# EasyEDA Pro project PCB.eprj

# Schematic Schematic1
Create Date: 2023-09-20; Page Name: P1; Project Name: 89C52RC灯板; Schematic Name: Schematic1; Update Date: 2023-09-20; Company: 嘉立创EDA; Page Size: A4; Version: V1.0
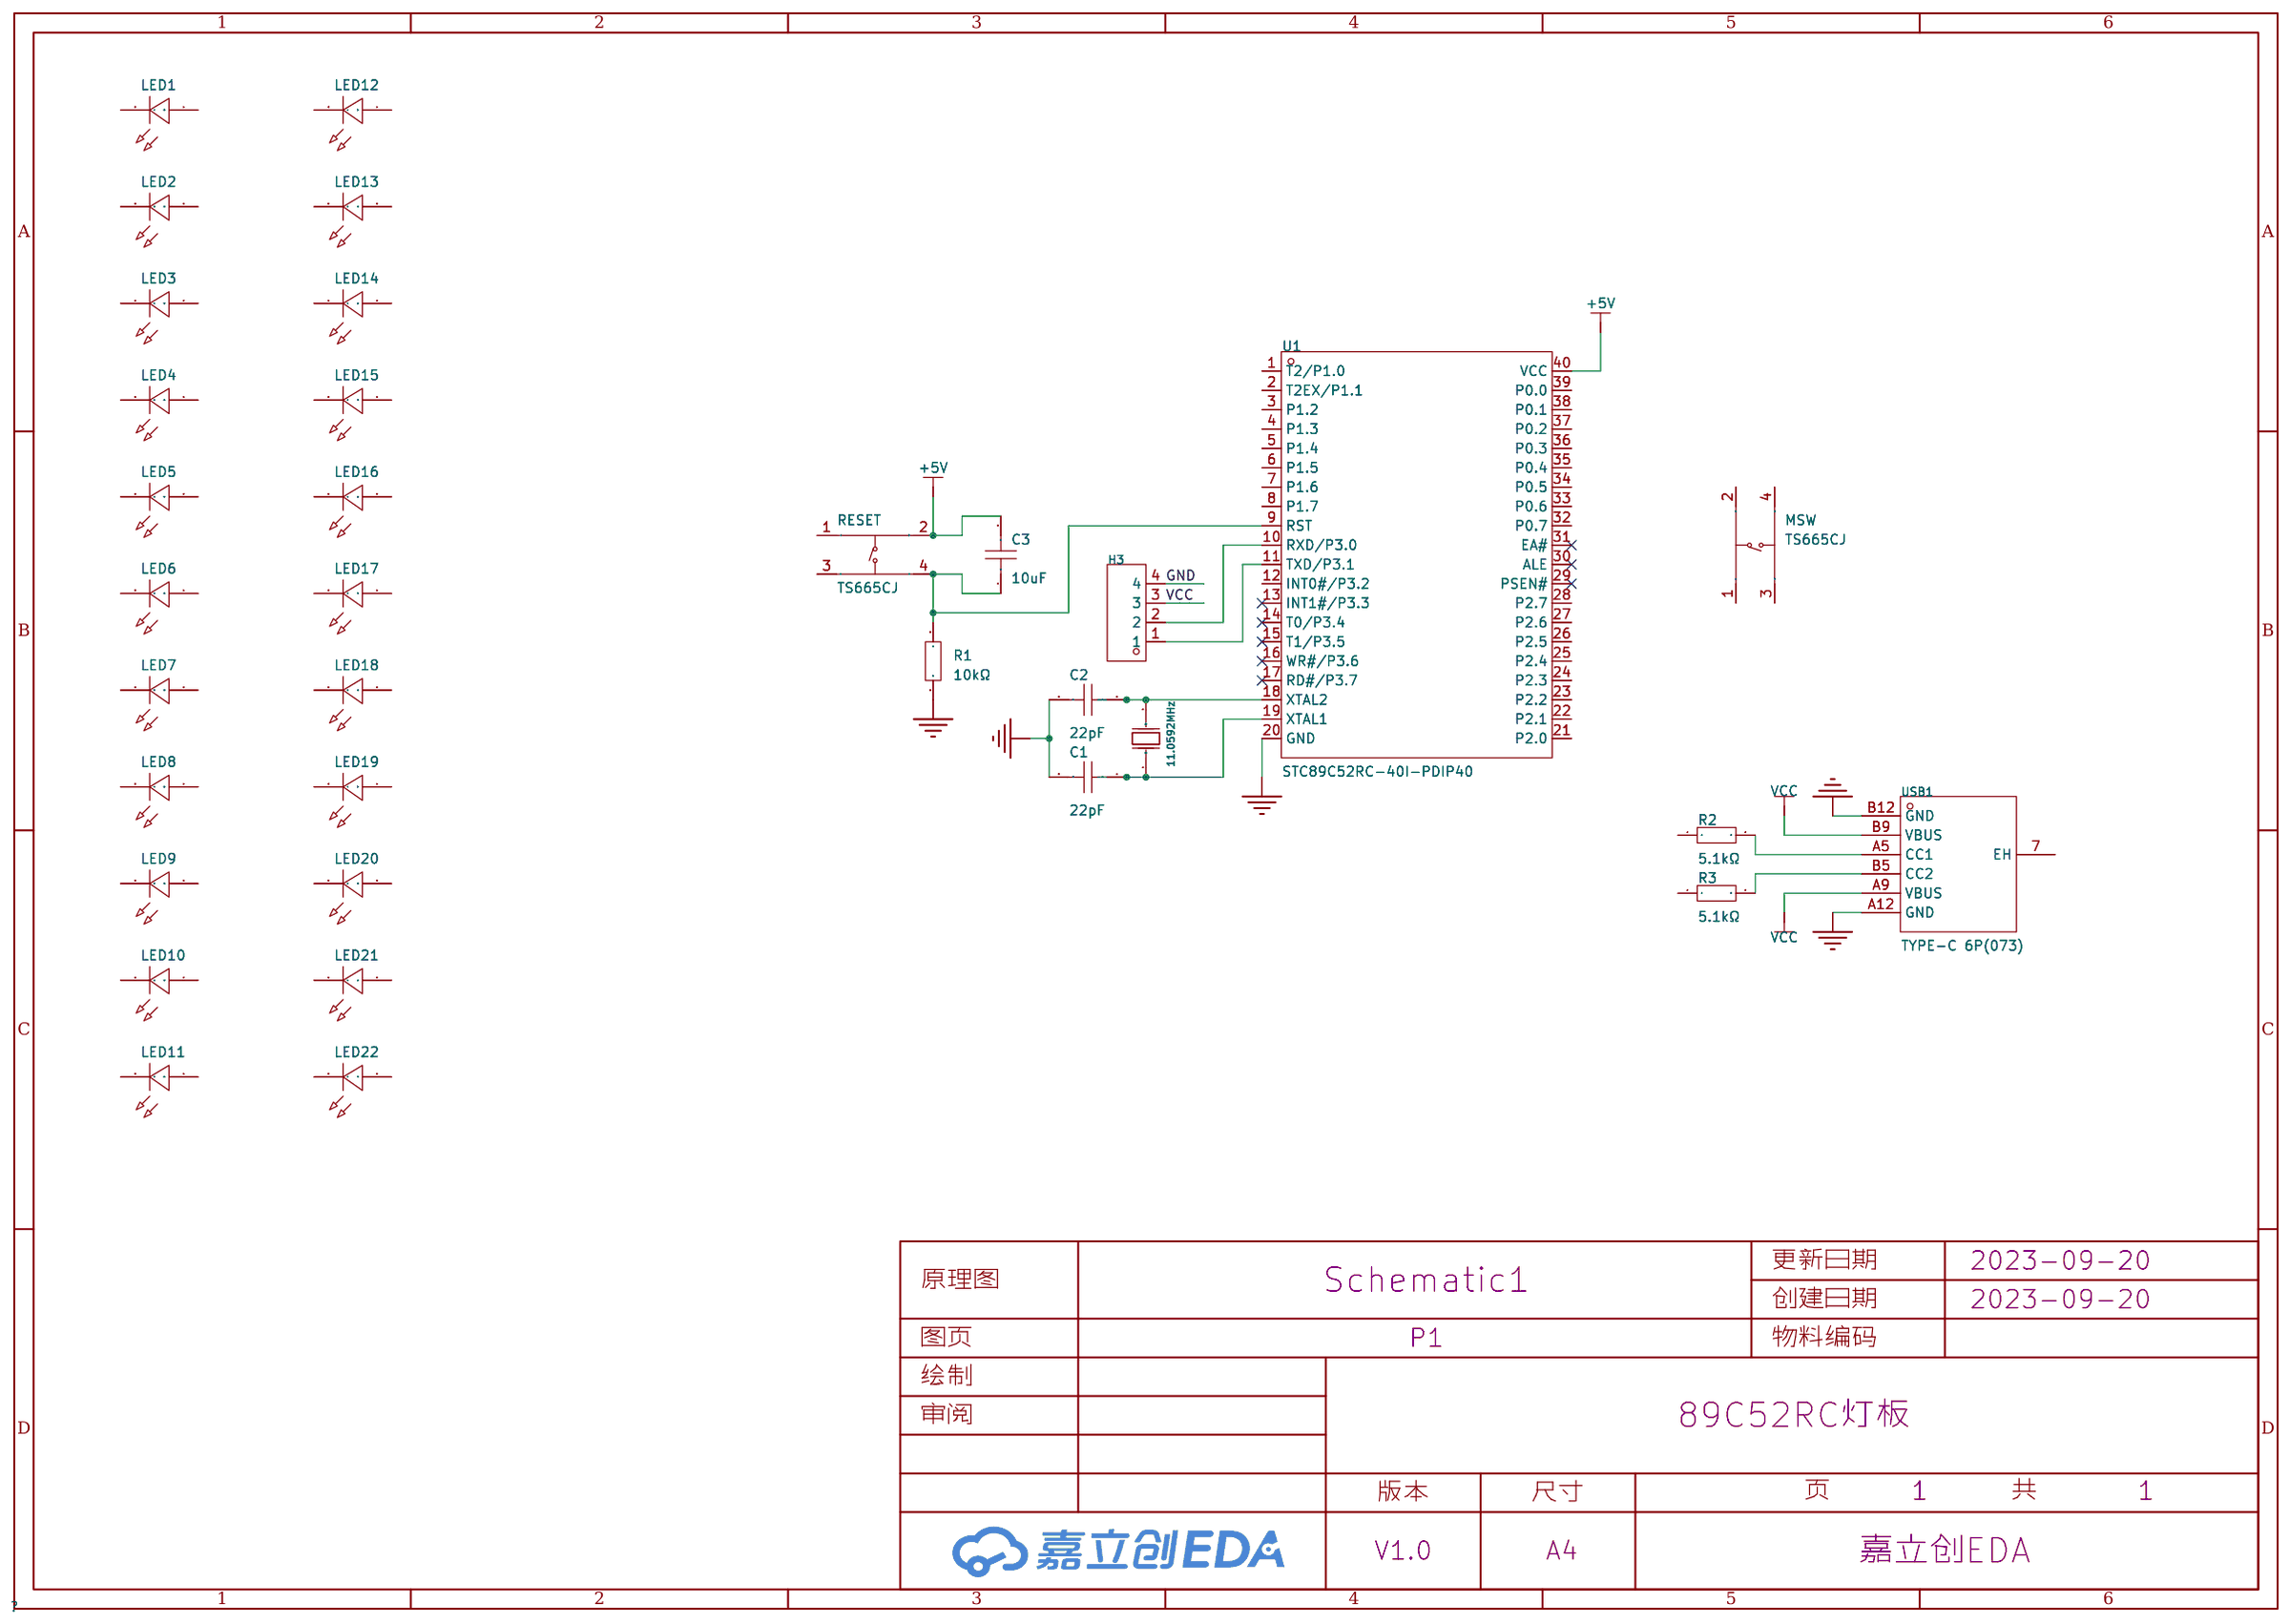
[diagram p0: schematic sheet]

## Parts
C1  22pF  [C0603]
C2  22pF  [C0603]
C3  10uF  [C0603]
H3  PZ254V-11-04P  [HDR-TH_4P-P2.54-V-M]
LED1  -  [LED_TH-_5mm]
LED2  -  [LED_TH-_5mm]
LED3  -  [LED_TH-_5mm]
LED4  -  [LED_TH-_5mm]
LED5  -  [LED_TH-_5mm]
LED6  -  [LED_TH-_5mm]
LED7  -  [LED_TH-_5mm]
LED8  -  [LED_TH-_5mm]
LED9  -  [LED_TH-_5mm]
LED10  -  [LED_TH-_5mm]
LED11  -  [LED_TH-_5mm]
LED12  -  [LED_TH-_5mm]
LED13  -  [LED_TH-_5mm]
LED14  -  [LED_TH-_5mm]
LED15  -  [LED_TH-_5mm]
LED16  -  [LED_TH-_5mm]
LED17  -  [LED_TH-_5mm]
LED18  -  [LED_TH-_5mm]
LED19  -  [LED_TH-_5mm]
LED20  -  [LED_TH-_5mm]
LED21  -  [LED_TH-_5mm]
LED22  -  [LED_TH-_5mm]
MSW  TS665CJ  [SW-TH_4P-L6.0-W6.0-P4.50-LS6.5]
R1  10kΩ  [R0603]
R2  5.1kΩ  [R0603]
R3  5.1kΩ  [R0603]
RESET  TS665CJ  [SW-TH_4P-L6.0-W6.0-P4.50-LS6.5]
U1  STC89C52RC-40I-PDIP40  [DIP-40_L52.0-W13.7-P2.54-LS15.2-BL]
USB1  TYPE-C 6P(073)  [TYPE-C-SMD_TYPE-C-6P]
X1  11.0592MHz  [HC-49US_L11.5-W4.5-P4.88]

## Library data of the parts
C1 C2 = 0603CG220J500NT: 温度系数:C0G;精度:±5%;额定电压:50V;容值:22pF;; LCSC Part Name: 22pF(220) ±5% 50V; Supplier Part: C91701; Manufacturer: FH(风华); Supplier Footprint: 0603; JLCPCB Part Class: 扩展库; Datasheet: https://atta.szlcsc.com/upload/public/pdf/source/20170923/C91701_1506149567492988977.pdf; Supplier: LCSC; Temperature Coefficient: C0G; Tolerance: ±5%; Voltage Rated: 50V
C3 = CL10A106KP8NNNC: 容值:10uF;精度:±10%;额定电压:10V;材质(温度系数):X5R;; LCSC Part Name: 10uF ±10% 10V; Supplier Part: C19702; Manufacturer: SAMSUNG(三星); Supplier Footprint: 0603; JLCPCB Part Class: 基础库; Datasheet: https://atta.szlcsc.com/upload/public/pdf/source/20160103/1457707703378.pdf; Supplier: LCSC; Tolerance: ±10%; Voltage Rated: 10V; Temperature Coefficient: X5R
H3 = PZ254V-11-04P: 排数:单排;总PIN位数:4P;间距:2.54mm;插针结构:1x4P;行距:-;安装类型:直插;圆针/方针:方针;额定电流:3A;额定电压:250V;配合针长度:6mm;塑高:2.5mm;端接针长度:3mm;触头材质:-;工作温度范围:-40℃~+105℃;颜色:黑色;; LCSC Part Name: 2.54mm 1x4P 直插 方针; Supplier Part: C2691448; Manufacturer: XFCN(兴飞); Supplier Footprint: 插件,P=2.54mm; JLCPCB Part Class: 扩展库; Datasheet: https://atta.szlcsc.com/upload/public/pdf/source/20200309/C492403_F9F19131791D08044AD4F84F8E751A34.pdf; Supplier: LCSC; Number of Rows: 单排; Number of Pins: 4P; Pitch: 2.54mm; Pin Structure: 1x4P; Mounting Type: 直插; Circluar Pins/Square Pins: 方针; Current Rating (Max): 3A; Voltage Rating (Max): 250V; Length of Mating Pin: 6mm; Insulation Height: 2.5mm; Length of End Connection Pin: 3mm; Operating Temperature Range: -40℃~+105℃; Color: 黑色
LED1-LED22 = LED_TH-G_5mm: Supplier Footprint: 插件
MSW RESET = TS665CJ: 触点电流:50mA;额定电压(DC):12V;电路结构:单刀单掷;安装方式:直插;带灯:-;机械寿命:-;; LCSC Part Name: 6*6*5mm 直插 轻触开关; Supplier Part: C393938; Manufacturer: SHOU HAN(首韩); Supplier Footprint: 插件; JLCPCB Part Class: 扩展库; Datasheet: https://atta.szlcsc.com/upload/public/pdf/source/20190521/C393938_BDABEAC600B4C55E200A80AA129B70BC.pdf; Supplier: LCSC; Contact Current: 50mA; Voltage Rating (DC): 12V; Circuit: 单刀单掷; Mounting Style: 直插; Actuator Style: 圆形按钮; Switch Length: 6mm; Switch Width: 6mm; Switch Height: 5mm
R1 = 0603WAF1002T5E: 电阻类型:厚膜电阻;阻值:10kΩ;精度:±1%;功率:100mW;; LCSC Part Name: 厚膜电阻 10kΩ ±1% 100mW; Supplier Part: C25804; Manufacturer: UNI-ROYAL(厚声); Supplier Footprint: 0603; JLCPCB Part Class: 基础库; Datasheet: https://atta.szlcsc.com/upload/public/pdf/source/20200306/C422600_1E6D84923E4A46A82E41ADD87F860B5C.pdf; Supplier: LCSC; Type: 厚膜电阻; Tolerance: ±1%; Power(Watts): 100mW; Temperature Coefficient: ±100ppm/℃; Overload Voltage (Max): 75V; Operating Temperature Range: -55℃~+155℃
R2 R3 = 0603WAF5101T5E: 电阻类型:厚膜电阻;阻值:5.1kΩ;精度:±1%;功率:100mW;; LCSC Part Name: 5.1kΩ ±1% 100mW; Supplier Part: C23186; Manufacturer: UNI-ROYAL(厚声); Supplier Footprint: 0603; JLCPCB Part Class: 基础库; Datasheet: https://atta.szlcsc.com/upload/public/pdf/source/20200306/C422600_1E6D84923E4A46A82E41ADD87F860B5C.pdf; Supplier: LCSC; Type: 厚膜电阻; Tolerance: ±1%; Power(Watts): 100mW; Temperature Coefficient: ±100ppm/℃; Overload Voltage (Max): 75V; Operating Temperature Range: -55℃~+155℃
U1 = STC89C52RC-40I-PDIP40: CPU内核:51系列;CPU最大主频:-;工作电压范围:3.3V~5.5V;内部振荡器:-;外部时钟频率范围:-;程序 FLASH容量:8KB;RAM总容量:512Byte;EEPROM/数据 FLASH容量:4KB;GPIO端口数量:35;ADC(单元数/通道数/位数):-;DAC(单元数/通道数/位数):-;(E)PWM(单元数/通道数/位数):-;8位Timer数量:-;16位Timer数量:3;32位Timer数量:-;内部比较器数量:-;U(S)ART路数:1;I2C路数:-;I2S路数:-;(; LCSC Part Name: 51系列 闪存：8KB RAM：512Byte; Supplier Part: C14022; Manufacturer: STC(宏晶); Supplier Footprint: DIP-40; Datasheet: https://atta.szlcsc.com/upload/public/pdf/source/20210104/C14022_3E6032FDBB5DBC6F971AD019A8472F5B.pdf; Supplier: LCSC; CPU Core: 51系列; Supply Voltage Range: 3.3V~5.5V; Program FLASH Size: 8KB; RAM Size: 512Byte; EEPROM/Data FLASH Size: 4KB; GPIO Ports Number: 35; 16Bit Timer Number: 3; U(S)ART Number: 1; Peripherals / Functions / Protocol Stacks: 看门狗; Operating Temperature Range: -40℃~+85℃
USB1 = TYPE-C 6P(073): 连接器类型:Type-C;标准:-;公母:母座;触点数量:6P;端口数量:1;安装方式:卧贴;额定电流 - 电源:5A;工作温度范围:-25℃~+85℃;; LCSC Part Name: Type-C 母座 卧贴; Supplier Part: C668623; Manufacturer: SHOU HAN(首韩); Supplier Footprint: SMD; JLCPCB Part Class: 扩展库; Datasheet: https://atta.szlcsc.com/upload/public/pdf/source/20200618/C668623_A4B260DED7AC1949BAC6AE39E9F4CD80.pdf; Supplier: LCSC; Connector Type: Type-C; Gender: 母座; Number of Contacts: 6P; Number of Ports: 1; Mounting Style: 卧贴; Current Rating - Power (Max): 5A; Operating Temperature Range: -25℃~+85℃
X1 = X49SD110592MSD2SC: 频率:11.0592MHz;频率公差:±20ppm;负载电容:20pF;; LCSC Part Name: 11.0592MHz ±20ppm 20pF HC-49US; Supplier Part: C2203; Manufacturer: YXC(扬兴晶振); Supplier Footprint: HC-49S; JLCPCB Part Class: 扩展库; Datasheet: https://atta.szlcsc.com/upload/public/pdf/source/20210903/A997D130AE99CBB55D9024F9BE6DA174.pdf; Supplier: LCSC; Crystal Type: 49S晶振; Frequency Tolerance: ±20ppm; Frequency Stability: ±30ppm; Load Capacitance: 20pF; Operating Temperature: -20℃~+70℃

## Nets
+5V: C3.2 RESET.2(B) U1.40(VCC)
GND: C1.2 C2.2 H3.4 R1.1 U1.20(GND) USB1.A12(GND) USB1.B12(GND)
VCC: H3.3 USB1.A9(VBUS) USB1.B9(VBUS)
$1N1991: C2.1 U1.18(XTAL2) X1.2(OSC2)
$1N2027: C1.1 U1.19(XTAL1) X1.1(OSC1)
$1N4044: R2.2 USB1.A5(CC1)
$1N4048: R3.2 USB1.B5(CC2)
Net-(H3-1): H3.1 U1.11(TXD/P3.1)
Net-(H3-2): H3.2 U1.10(RXD/P3.0)
RST: C3.1 R1.2 RESET.4(D) U1.9(RST)

Not connected (* = marked no-connect by the designer): LED1 1(C) 2(A); LED2 1(C) 2(A); LED3 1(C) 2(A); LED4 1(C) 2(A); LED5 1(C) 2(A); LED6 1(C) 2(A); LED7 1(C) 2(A); LED8 1(C) 2(A); LED9 1(C) 2(A); LED10 1(C) 2(A); LED11 1(C) 2(A); LED12 1(C) 2(A); LED13 1(C) 2(A); LED14 1(C) 2(A); LED15 1(C) 2(A); LED16 1(C) 2(A); LED17 1(C) 2(A); LED18 1(C) 2(A); LED19 1(C) 2(A); LED20 1(C) 2(A); LED21 1(C) 2(A); LED22 1(C) 2(A); MSW 1(A) 2(B) 3(C) 4(D); R2 1; R3 1; RESET 1(A) 3(C); U1 1(T2/P1.0) 2(T2EX/P1.1) 3(P1.2) 4(P1.3) 5(P1.4) 6(P1.5) 7(P1.6) 8(P1.7) 12(INT0#/P3.2) 13(INT1#/P3.3)* 14(T0/P3.4)* 15(T1/P3.5)* 16(WR#/P3.6)* 17(RD#/P3.7)* 21(P2.0) 22(P2.1) 23(P2.2) 24(P2.3) 25(P2.4) 26(P2.5) 27(P2.6) 28(P2.7) 29(PSEN#)* 30(ALE)* 31(EA#)* 32(P0.7) 33(P0.6) 34(P0.5) 35(P0.4) 36(P0.3) 37(P0.2) 38(P0.1) 39(P0.0); USB1 7(EH)

# Board PCB1
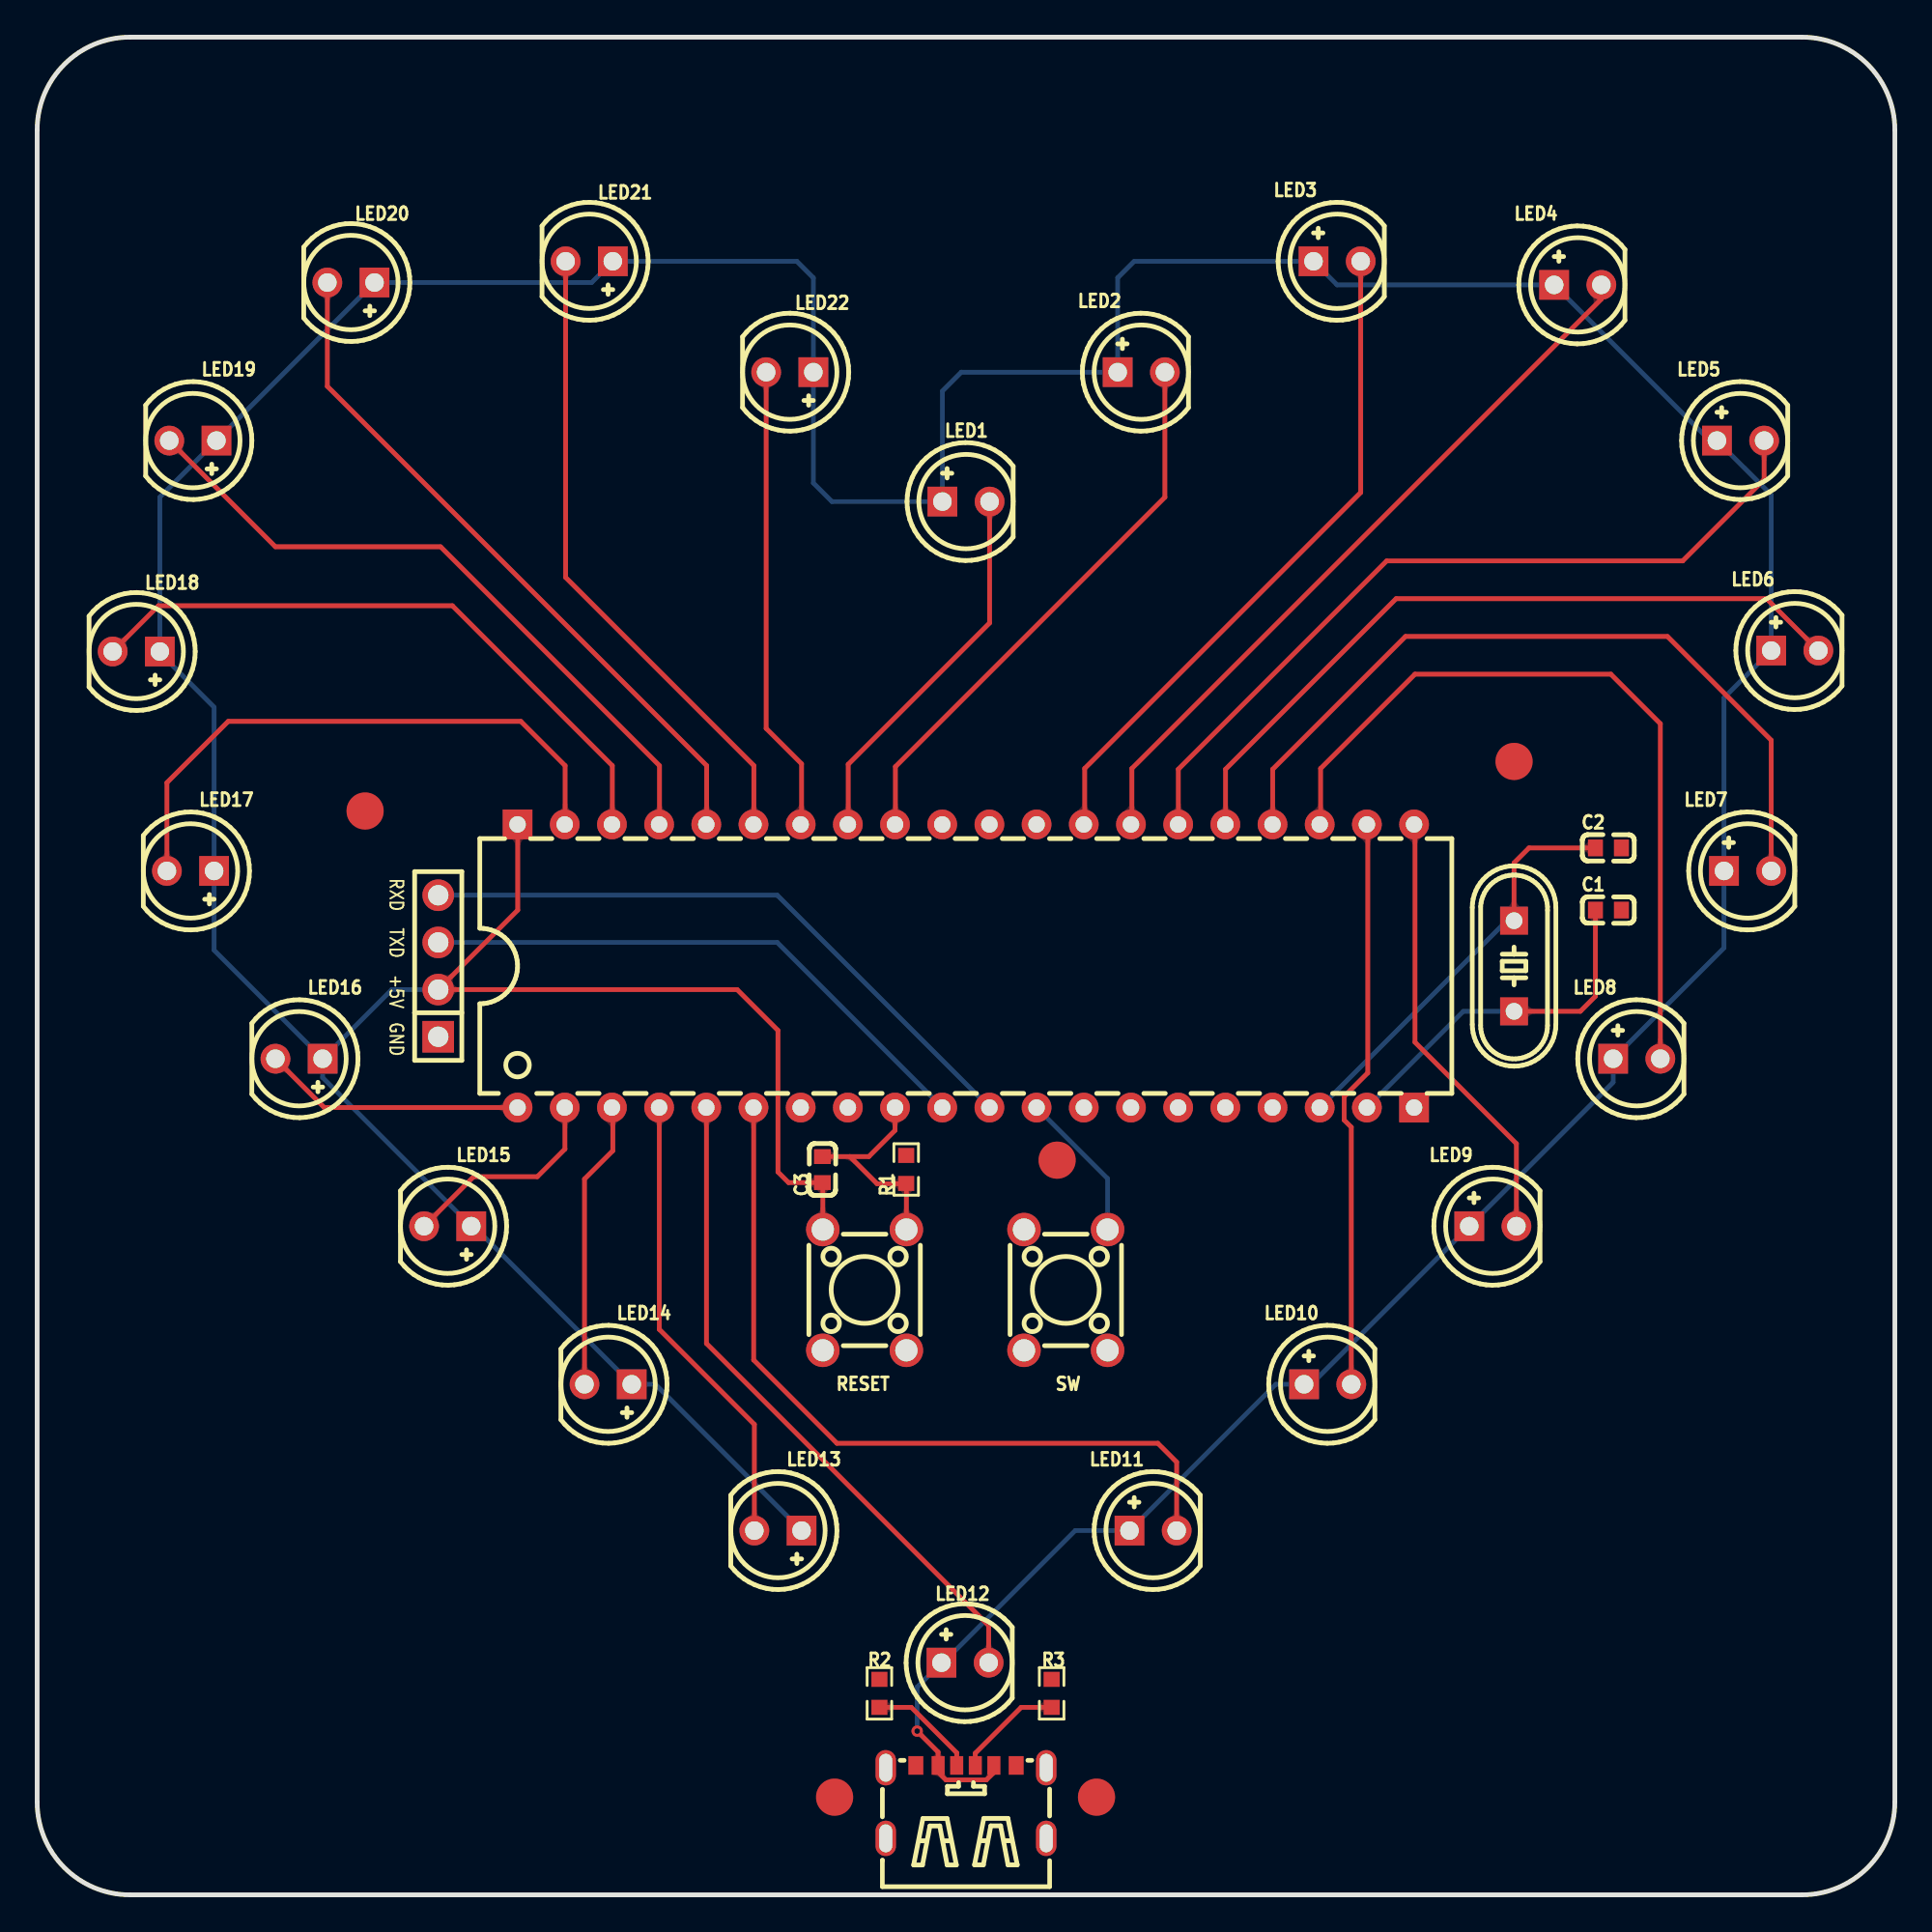
[diagram p1: board, top side]
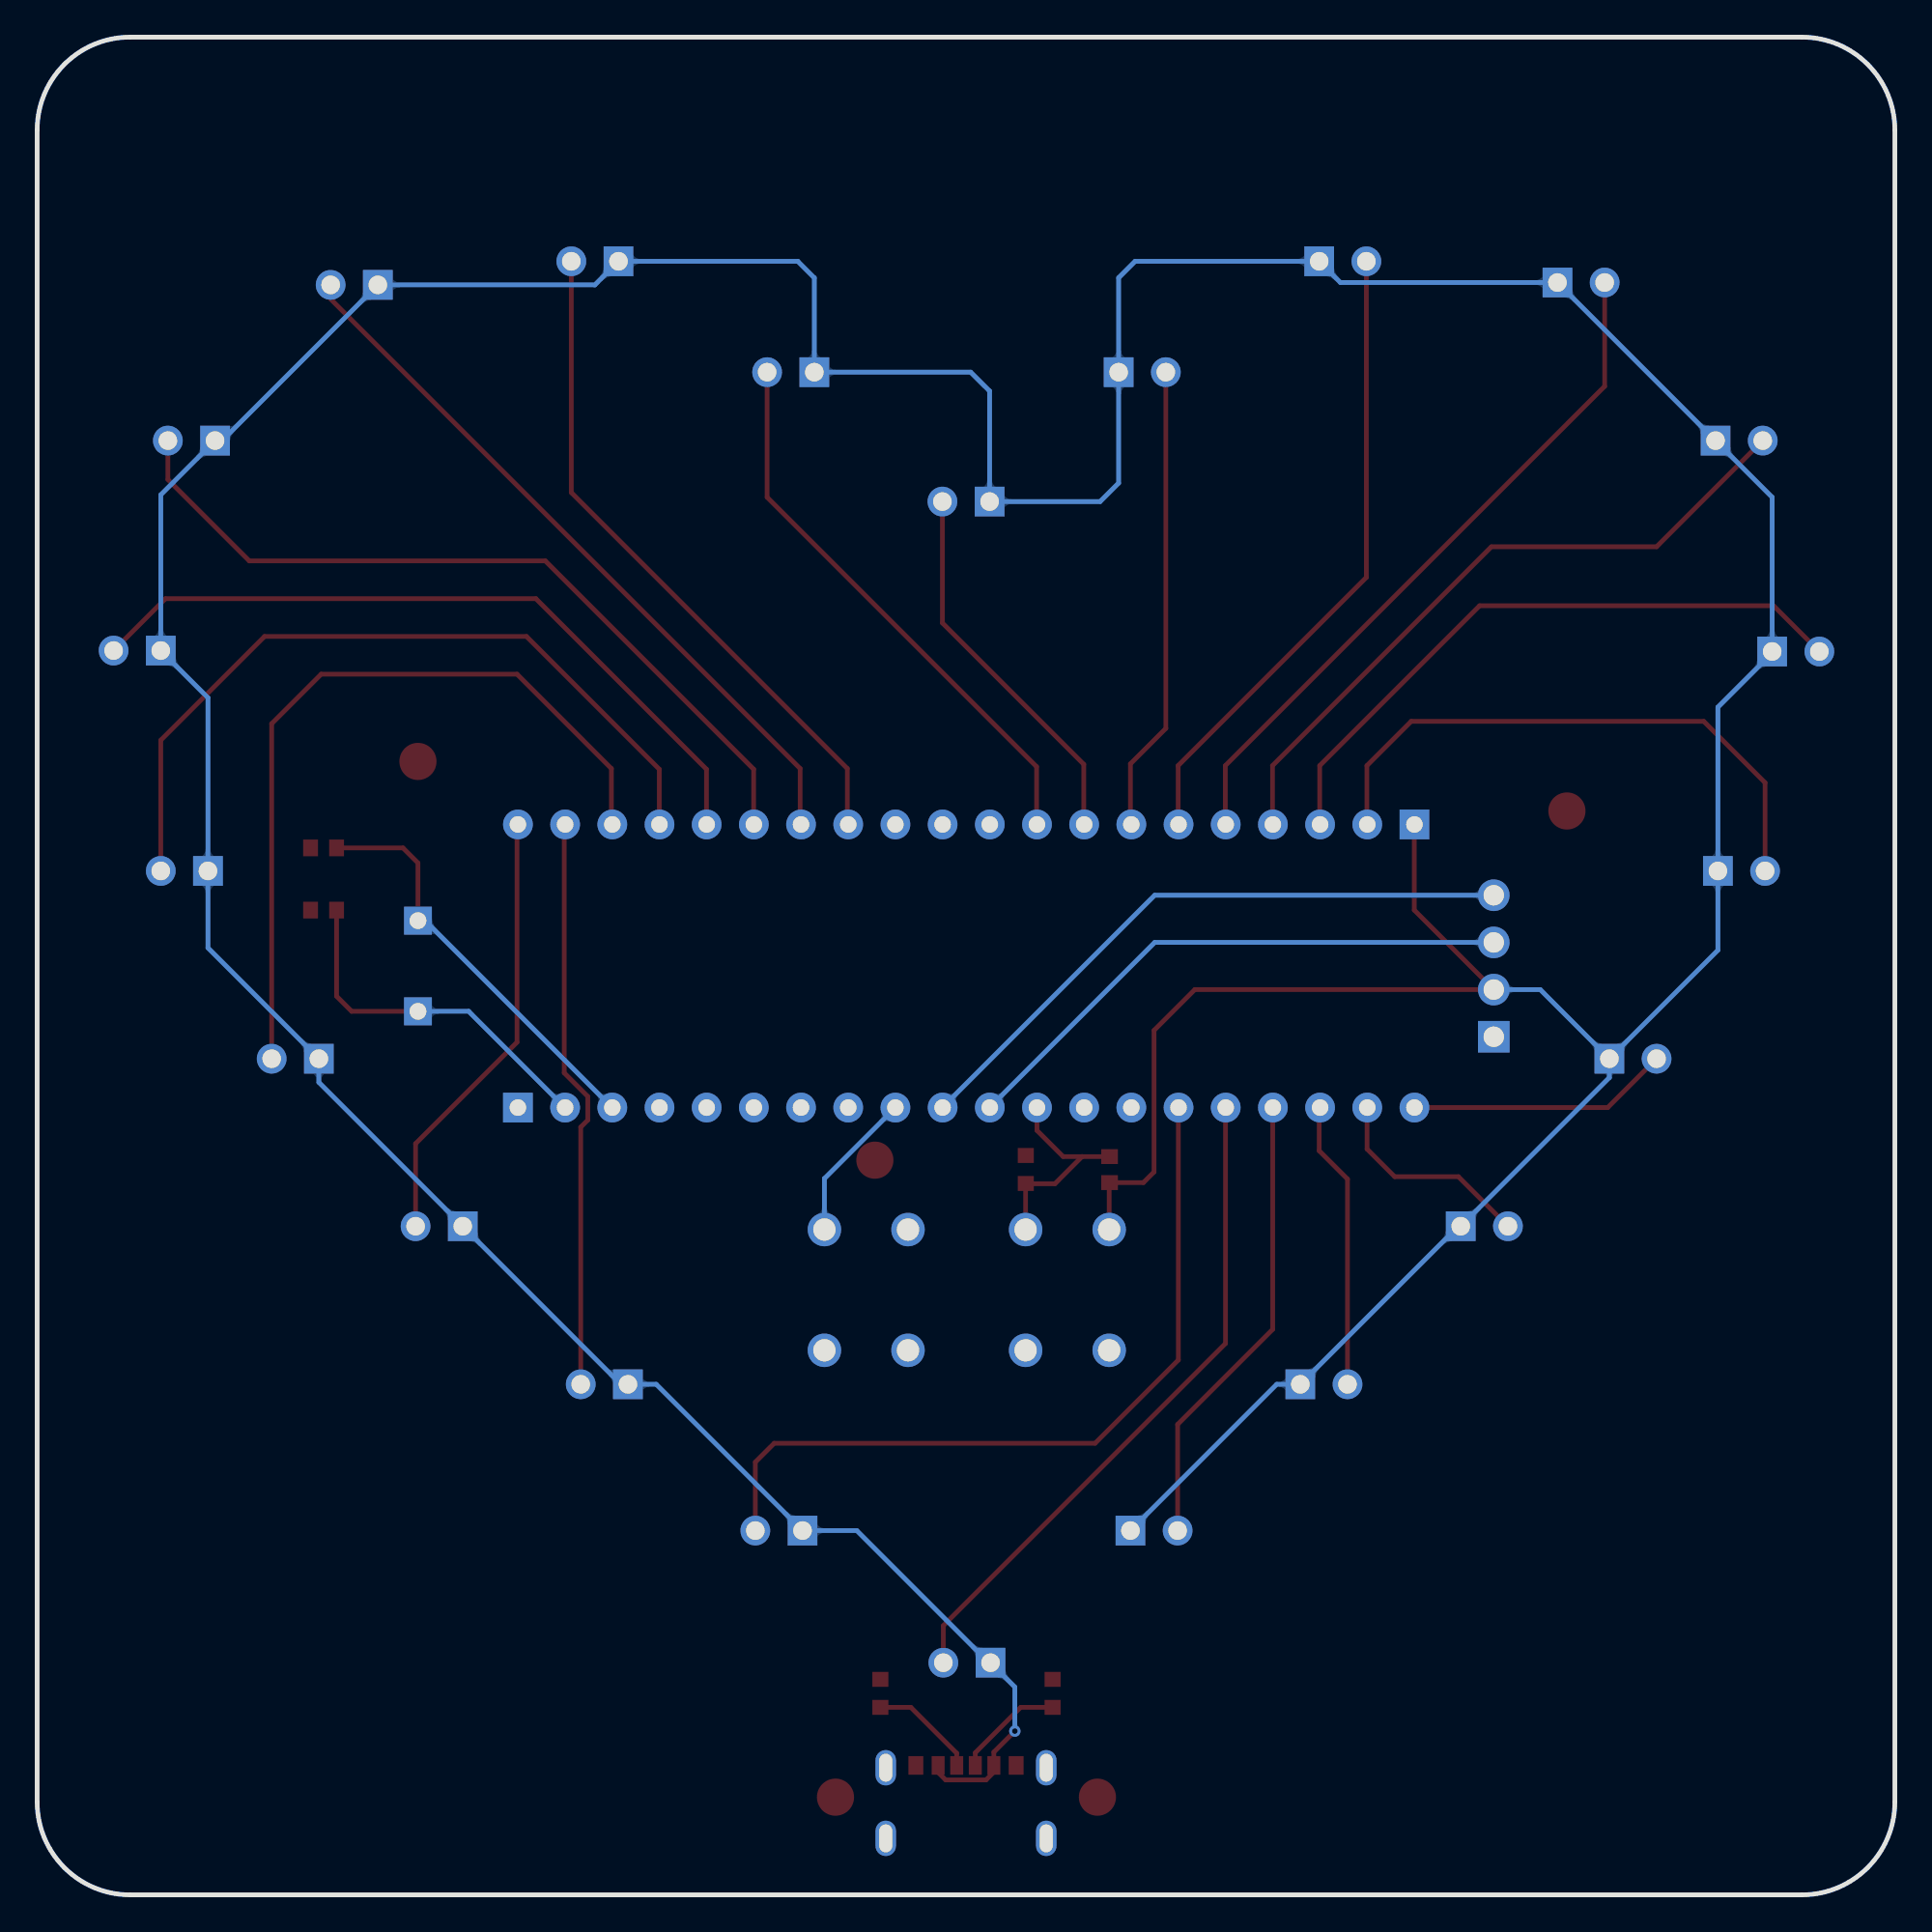
[diagram p2: board, bottom side, seen from below]

Outline 100 x 100 mm; copper layers: Top Layer, Bottom Layer. Coordinates in mm from the lower left corner of the outline.
Outline path: 0,95 0,5 arc(1.46,1.46) 5,0 95,0 arc(98.54,1.46) 100,5 100,95 arc(98.54,98.54) 95,100 5,100 arc(1.46,98.54) 0,95
Stack: Top Layer 0.035mm / Dielectric1 1.51mm FR4 er 4.5 / Bottom Layer 0.035mm

## Design rules (mm)
template: JLCPCB Capability(Two Layers Board)
spacing copperThickness1oz (default): track to track 0.102, other pairs 0.152 to 0.3
spacing copperThickness2oz: track to track 0.203, other pairs 0.152 to 0.3
track width copperThickness1oz (default): min 0.127, default 0.254, max 2.54
track width copperThickness2oz: min 0.203, default 0.254, max 2.54
differential pair differentialPair (default): width min 0.127, default 0.254, max 2.54; gap min 0.152, default 0.152
via viaSize (default): diameter min 0.5, default 0.61, max 10; hole min 0.3, default 0.305, max 6.3

## Placement (name value [footprint] x y rotation side)
C1  22pF  [C0603]  84.58 53.01 0 top
C2  22pF  [C0603]  84.58 56.36 0 top
C3  10uF  [C0603]  42.27 39.04 270 top
H3  PZ254V-11-04P  [hdr-th_4p-p2.54-v-m]  21.59 50 90 top
LED1  -  [LED_TH-_5mm]  50 75 0 top
LED2  -  [LED_TH-_5mm]  59.44 81.97 0 top
LED3  -  [LED_TH-_5mm]  69.98 87.94 0 top
LED4  -  [LED_TH-_5mm]  82.93 86.67 0 top
LED5  -  [LED_TH-_5mm]  91.69 78.28 0 top
LED6  -  [LED_TH-_5mm]  94.62 66.98 0 top
LED7  -  [LED_TH-_5mm]  92.07 55.12 0 top
LED8  -  [LED_TH-_5mm]  86.11 45.01 0 top
LED9  -  [LED_TH-_5mm]  78.36 35.99 0 top
LED10  -  [LED_TH-_5mm]  69.47 27.48 0 top
LED11  -  [LED_TH-_5mm]  60.07 19.61 0 top
LED12  -  [LED_TH-_5mm]  49.95 12.5 0 top
LED13  -  [LED_TH-_5mm]  39.88 19.61 180 top
LED14  -  [LED_TH-_5mm]  30.73 27.48 180 top
LED15  -  [LED_TH-_5mm]  22.1 35.99 180 top
LED16  -  [LED_TH-_5mm]  14.1 45.01 180 top
LED17  -  [LED_TH-_5mm]  8.25 55.12 180 top
LED18  -  [LED_TH-_5mm]  5.33 66.93 180 top
LED19  -  [LED_TH-_5mm]  8.38 78.28 180 top
LED20  -  [LED_TH-_5mm]  16.89 86.79 180 top
LED21  -  [LED_TH-_5mm]  29.72 87.94 180 top
LED22  -  [LED_TH-_5mm]  40.51 81.97 180 top
NOREF  -  [Pad_e78]  79.5 61.01 0 top
NOREF#2  -  [Pad_e80]  54.91 39.55 0 top
NOREF#3  -  [Pad_e82]  42.93 5.26 0 top
NOREF#4  -  [Pad_e341]  17.65 58.34 0 top
NOREF#5  -  [Pad_e81]  57.03 5.26 0 top
R1  10kΩ  [R0603]  46.78 39.05 270 top
R2  5.1kΩ  [R0603]  45.34 10.85 270 top
R3  5.1kΩ  [R0603]  54.61 10.85 270 top
RESET  TS665CJ  [SW-TH_4P-L6.0-W6.0-P4.50-LS6.5]  44.54 32.56 90 top
SW  TS665CJ  [SW-TH_4P-L6.0-W6.0-P4.50-LS6.5]  55.37 32.56 90 top
U1  STC89C52RC-40I-PDIP40  [dip-40_l52.0-w13.7-p2.54-ls15.2-bl]  49.99 50 0 top
USB1  TYPE-C 6P(073)  [TYPE-C-SMD_TYPE-C-6P]  50 5 0 top
X1  11.0592MHz  [hc-49us_l11.5-w4.5-p4.88]  79.5 50 90 top

## Footprints (pads in the part's own frame, mm; a bottom-side part is the same pattern mirrored in y, then rotated)
C0603
  rect 0.8x0.9 smd: 1(-0.7,0) 2(0.7,0)
dip-40_l52.0-w13.7-p2.54-ls15.2-bl
  round 1.6 hole 0.889: 1(-24.13,-7.62) 2(-21.59,-7.62) 3(-19.05,-7.62) 4(-16.51,-7.62) 5(-13.97,-7.62) 6(-11.43,-7.62) 7(-8.89,-7.62) 8(-6.35,-7.62) 9(-3.81,-7.62) 10(-1.27,-7.62) 11(1.27,-7.62) 12(3.81,-7.62) 13(6.35,-7.62) 14(8.89,-7.62) 15(11.43,-7.62) 16(13.97,-7.62) 17(16.51,-7.62) 18(19.05,-7.62) 19(21.59,-7.62) 21(24.13,7.62) 22(21.59,7.62) 23(19.05,7.62) 24(16.51,7.62) 25(13.97,7.62) 26(11.43,7.62) 27(8.89,7.62) 28(6.35,7.62) 29(3.81,7.62) 30(1.27,7.62) 31(-1.27,7.62) 32(-3.81,7.62) 33(-6.35,7.62) 34(-8.89,7.62) 35(-11.43,7.62) 36(-13.97,7.62) 37(-16.51,7.62) 38(-19.05,7.62) 39(-21.59,7.62)
  rect 1.6x1.6 hole 0.889: 20(24.13,-7.62) 40(-24.13,7.62)
hc-49us_l11.5-w4.5-p4.88
  rect 1.5x1.5 hole 0.9: 1(-2.44,0) 2(2.44,0)
hdr-th_4p-p2.54-v-m
  rect 1.7x1.7 hole 1.1: 1(-3.81,0)
  round 1.7 hole 1.1: 2(-1.27,0) 3(1.27,0) 4(3.81,0)
LED_TH-_5mm
  rect 1.6x1.6 hole 1: 1(-1.27,0)
  round 1.6 hole 1: 2(1.27,0)
Pad_e78
  round 2 smd: TP1(0,0)
Pad_e80
  round 2 smd: TP1(0,0)
Pad_e81
  round 2 smd: TP1(0,0)
Pad_e82
  round 2 smd: TP1(0,0)
Pad_e341
  round 2 smd: TP1(0,0)
R0603
  rect 0.806x0.864 smd: 1(-0.753,0) 2(0.753,0)
SW-TH_4P-L6.0-W6.0-P4.50-LS6.5
  round 1.8 hole 1.2: 1(-3.25,2.25) 2(3.25,2.25) 3(-3.25,-2.25) 4(3.25,-2.25)
TYPE-C-SMD_TYPE-C-6P
  oval 1.1x1.9 hole 0.7x1.5: 7(-4.32,1.837) 7(-4.32,-1.962) 7(4.32,1.837) 7(4.32,-1.962)
  rect 0.7x1 smd: A5(-0.5,1.962) A9(1.5,1.962) B5(0.5,1.962) B9(-1.5,1.962)
  rect 0.8x1 smd: A12(2.7,1.962) B12(-2.7,1.962)

## Nets
+5V: C3.2 H3.2 LED1.1 LED2.1 LED3.1 LED4.1 LED5.1 LED6.1 LED7.1 LED8.1 LED9.1 LED10.1 LED11.1 LED12.1 LED13.1 LED14.1 LED15.1 LED16.1 LED17.1 LED18.1 LED19.1 LED20.1 LED21.1 LED22.1 RESET.2 U1.40 USB1.A9 USB1.B9
GND: C1.2 C2.2 H3.1 NOREF.TP1 NOREF#2.TP1 NOREF#3.TP1 NOREF#4.TP1 NOREF#5.TP1 R1.1 R2.1 R3.1 SW.1 SW.2 U1.20 USB1.A12 USB1.B12
INT0: SW.4 U1.12
P00: LED17.2 U1.39
P01: LED18.2 U1.38
P02: LED19.2 U1.37
P03: LED20.2 U1.36
P04: LED21.2 U1.35
P05: LED22.2 U1.34
P06: LED1.2 U1.33
P07: LED2.2 U1.32
P10: LED16.2 U1.1
P11: LED15.2 U1.2
P12: LED14.2 U1.3
P13: LED13.2 U1.4
P14: LED12.2 U1.5
P15: LED11.2 U1.6
P20: LED9.2 U1.21
P21: LED10.2 U1.22
P22: LED8.2 U1.23
P23: LED7.2 U1.24
P24: LED6.2 U1.25
P25: LED5.2 U1.26
P26: LED4.2 U1.27
P27: LED3.2 U1.28
RST: C3.1 R1.2 RESET.4 U1.9
RXD: H3.3 U1.10
TXD: H3.4 U1.11
$1N1991: C2.1 U1.18 X1.2
$1N2027: C1.1 U1.19 X1.1
$1N4044: R2.2 USB1.A5
$1N4048: R3.2 USB1.B5

Pads without a net: RESET 1 3; SW 3; U1 7 8 13 14 15 16 17 29 30 31; USB1 7

## Via types
v1: diameter 0.61, hole 0.305, Top Layer to Bottom Layer, 1 via

## Routing (per net, layer and track width the routed paths; a pad name or vN(x,y) marks a point on that pad's centre or on a via; arc(x,y) is an arc through that point)
+5V: length 336.9
  Top Layer w0.254: v1(47.37,8.81) 48.5,7.69 USB1.B9 48.5,6.61 48.92,6.19 51.09,6.19 51.5,6.59 USB1.A9 ; RESET.2 42.29,38.32 C3.2 40.45,38.34 39.88,38.91 39.88,46.53 37.68,48.73 H3.2 25.87,53.01 25.87,57.62
  Bottom Layer w0.254: H3.2 19.09,48.73 15.37,45.01 ; LED13.1 33.27,27.48 LED14.1 23.5,35.99 LED15.1 15.37,43.99 15.37,45.01 ; 15.37,45.01 9.53,50.85 LED17.1 9.53,63.93 6.6,66.85 LED18.1 6.6,75.23 LED19.1 LED20.1 29.84,86.79 LED21.1 40.89,87.94 41.78,87.05 LED22.1 41.78,76 42.78,75 LED1.1 48.73,80.95 49.75,81.97 LED2.1 58.17,87.05 59.06,87.94 LED3.1 69.98,86.67 LED4.1 90.04,78.28 LED5.1 93.34,75.36 LED6.1 90.81,64.44 LED7.1 90.81,50.98 LED8.1 84.84,43.74 LED9.1 68.58,27.48 66.68,27.48 LED11.1 55.88,19.61 48.77,12.5 LED12.1 47.37,11.19 v1(47.37,8.81)
INT0: length 8.2
  Bottom Layer w0.254: U1.12 57.62,38.56 SW.4
P00: length 31.7
  Top Layer w0.254: LED17.2 6.98,59.87 10.29,63.17 26.03,63.17 28.42,60.78 28.42,57.63 28.41,57.62
P01: length 34.7
  Top Layer w0.254: 30.95,57.62 30.96,57.63 30.96,60.78 22.35,69.39 6.53,69.39 LED18.2
P02: length 36.8
  Top Layer w0.254: LED19.2 12.83,72.57 21.72,72.57 33.5,60.78 33.5,57.63 33.49,57.62
P03: length 37.6
  Top Layer w0.254: 15.62,86.79 15.62,81.2 36.04,60.78 36.04,57.63 36.03,57.62
P04: length 34.5
  Top Layer w0.254: 38.57,57.62 38.58,57.63 38.58,60.78 28.45,70.92 LED21.2
P05: length 25.2
  Top Layer w0.254: 41.11,57.62 41.15,57.66 41.15,60.88 39.24,62.79 LED22.2
P06: length 20.5
  Top Layer w0.254: 43.65,57.62 43.66,57.63 43.66,60.86 51.27,68.47 LED1.2
P07: length 30.4
  Top Layer w0.254: 46.19,57.62 46.2,57.63 46.2,60.73 60.71,75.23 LED2.2
P10: length 14.1
  Top Layer w0.254: 25.87,42.38 15.46,42.38 LED16.2
P11: length 11.5
  Top Layer w0.254: LED15.2 23.5,38.66 26.92,38.66 28.41,40.14 28.41,42.38
P12: length 15.5
  Top Layer w0.254: 30.95,42.38 30.99,42.34 30.99,40.06 29.46,38.53 LED14.2
P13: length 24.9
  Top Layer w0.254: 33.49,42.38 33.49,30.44 38.61,25.32 LED13.2
P14: length 36.2
  Top Layer w0.254: LED12.2 51.22,14.49 36.03,29.68 36.03,42.38
P15: length 42.3
  Top Layer w0.254: LED11.2 61.34,23.29 60.32,24.31 43.05,24.31 38.57,28.79 38.57,42.38
P20: length 23.9
  Top Layer w0.254: 74.13,57.62 74.17,57.58 74.17,45.9 79.63,40.44 79.63,35.99
P21: length 30.8
  Top Layer w0.254: LED10.2 70.74,41.33 70.36,41.71 70.36,42.98 71.63,44.25 71.63,57.58 71.59,57.62
P22: length 42.6
  Top Layer w0.254: LED8.2 87.38,63.04 84.71,65.71 74.17,65.71 69.09,60.63 69.09,57.66 69.05,57.62
P23: length 42.1
  Top Layer w0.254: LED7.2 93.34,62.15 87.76,67.74 73.66,67.74 66.51,60.59 66.51,57.62
P24: length 39.8
  Top Layer w0.254: 95.88,66.98 93.09,69.77 73.15,69.77 63.97,60.59 63.97,57.62
P25: length 43.1
  Top Layer w0.254: LED5.2 92.96,76.19 88.58,71.81 72.64,71.81 61.43,60.59 61.43,57.62
P26: length 39.5
  Top Layer w0.254: 58.89,57.62 58.93,57.66 58.93,60.63 84.2,85.9 84.2,86.67
P27: length 36.5
  Top Layer w0.254: LED3.2 71.25,75.49 56.39,60.63 56.39,57.66 56.35,57.62
RST: length 11.9
  Top Layer w0.254: C3.1 43.75,39.74 ; 43.75,39.74 44.77,39.74 46.18,41.15 U1.9 ; 43.75,39.74 45.21,38.28 46.76,38.28 R1.2 46.79,38.28 RESET.4
RXD: length 30.8
  Bottom Layer w0.254: H3.3 39.84,51.27 48.73,42.38
TXD: length 34.4
  Bottom Layer w0.254: H3.4 39.84,53.81 51.27,42.38
$1N1991: length 22.4
  Top Layer w0.254: X1.2 79.5,55.55 80.31,56.36 C2.1
  Bottom Layer w0.254: 69.05,42.38 79.11,52.44 X1.2
$1N2027: length 19.4
  Top Layer w0.254: X1.1 83.07,47.56 83.88,48.37 C1.1
  Bottom Layer w0.254: 71.59,42.38 76.77,47.56 X1.1
$1N4044: length 5.9
  Top Layer w0.254: USB1.A5 49.5,7.65 47.06,10.09 R2.2
$1N4048: length 5.8
  Top Layer w0.254: R3.2 52.97,10.09 50.5,7.62 USB1.B5

## Copper pours and planes (outline as drawn; the poured copper is in the pictures)
GND on Top Layer: 0,100 100,100 100,0 0,0
GND on Bottom Layer: 0,100 100,100 100,0 0,0

Small or netless copper shapes (teardrops, artwork), in the pictures only: 66 on Top Layer, 56 on Bottom Layer

## Text on the board
Top Silkscreen Layer: RXD | TXD | GND | +5V
